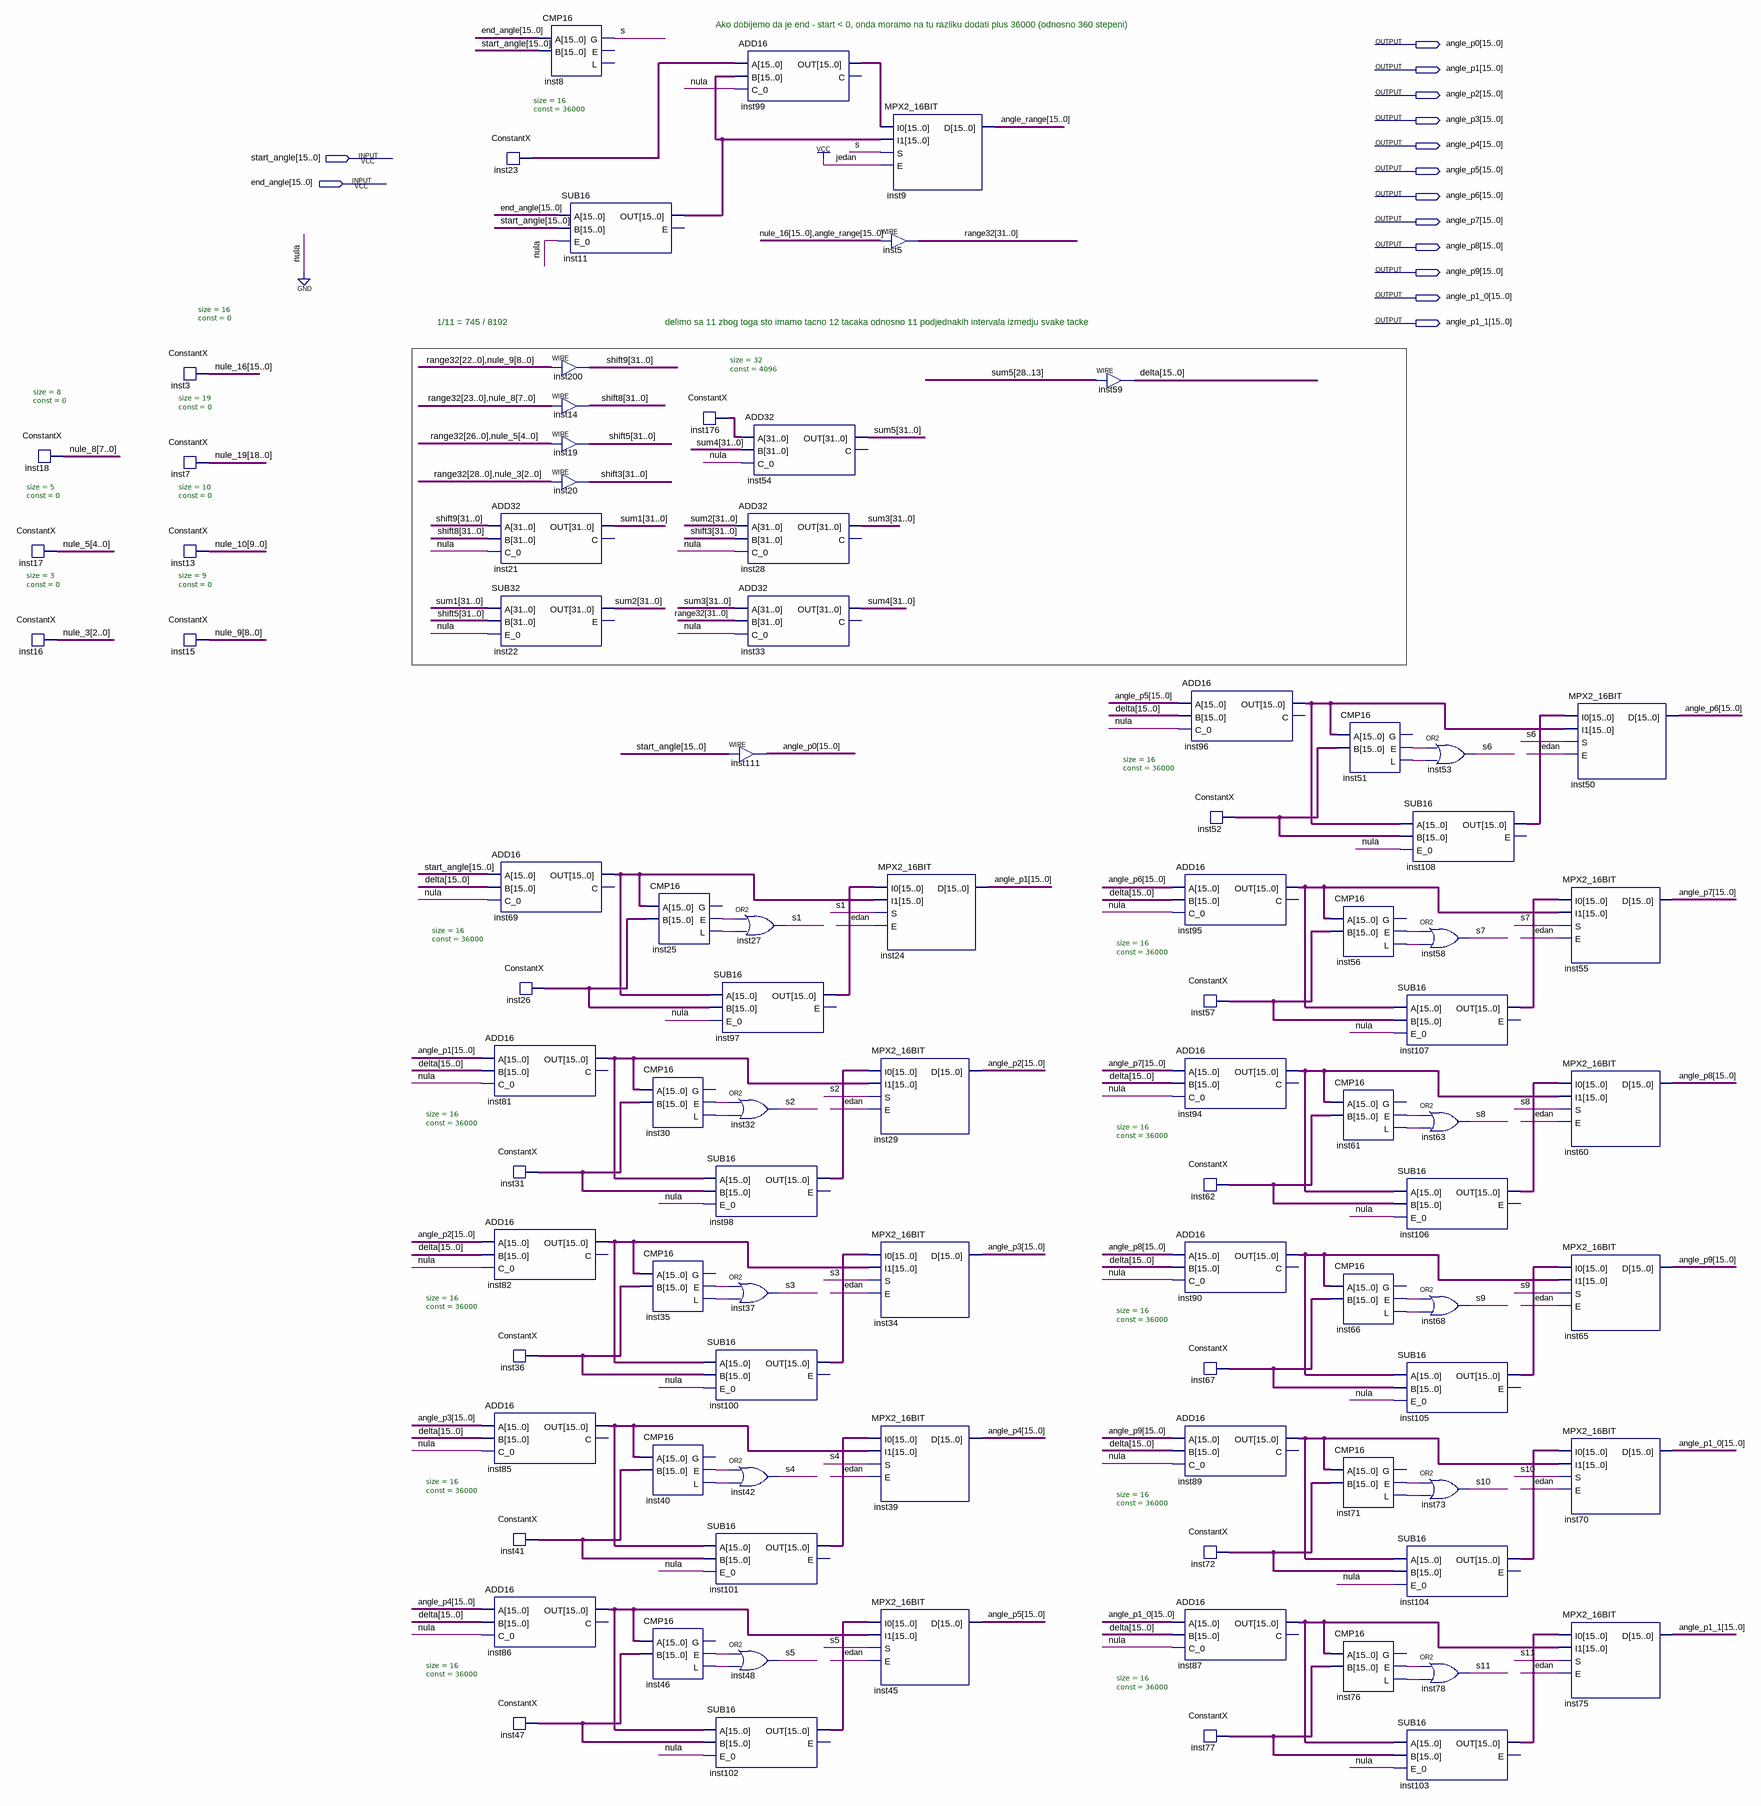
[diagram p0: schematic sheet]
// Quartus schematic AngleGenerator.bdf as structural Verilog: 91 symbols, 14 pins
module AngleGenerator (
  input  [15:0] start_angle,
  input  [15:0] end_angle,
  output [15:0] angle_p0,
  output [15:0] angle_p1,
  output [15:0] angle_p2,
  output [15:0] angle_p3,
  output [15:0] angle_p4,
  output [15:0] angle_p5,
  output [15:0] angle_p6,
  output [15:0] angle_p7,
  output [15:0] angle_p8,
  output [15:0] angle_p9,
  output [15:0] angle_p1_0,
  output [15:0] angle_p1_1
);

  wire inst25_e, inst25_l, inst30_e, inst30_l, inst35_e, inst35_l, inst40_e, inst40_l, inst46_e, inst46_l,
       inst51_e, inst51_l, inst56_e, inst56_l, inst61_e, inst61_l, inst66_e, inst66_l, inst71_e, inst71_l,
       inst76_e, inst76_l, s, s1, s2, s3, s4, s5, s6, s7, s8, s9, s10, s11;
  wire [2:0] nule_3;
  wire [4:0] nule_5;
  wire [7:0] nule_8;
  wire [8:0] nule_9;
  wire [9:0] nule_10;
  wire [15:0] angle_range, delta, inst11_out, inst23_data_out, inst26_data_out, inst31_data_out,
       inst36_data_out, inst41_data_out, inst47_data_out, inst52_data_out, inst57_data_out, inst62_data_out,
       inst67_data_out, inst69_out, inst72_data_out, inst77_data_out, inst81_out, inst82_out, inst85_out,
       inst86_out, inst87_out, inst89_out, inst90_out, inst94_out, inst95_out, inst96_out, inst97_out,
       inst98_out, inst99_out, inst100_out, inst101_out, inst102_out, inst103_out, inst104_out, inst105_out,
       inst106_out, inst107_out, inst108_out, nule_16;
  wire [18:0] nule_19;
  wire [31:0] inst176_data_out, range32, shift3, shift5, shift8, shift9, sum1, sum2, sum3, sum4, sum5;

  ConstantX #(.size(8), .\const (0)) inst18 (.DATA_OUT(nule_8));
  ConstantX #(.size(5), .\const (0)) inst17 (.DATA_OUT(nule_5));
  ConstantX #(.size(3), .\const (0)) inst16 (.DATA_OUT(nule_3));
  ConstantX #(.size(16), .\const (0)) inst3 (.DATA_OUT(nule_16));
  ConstantX #(.size(19), .\const (0)) inst7 (.DATA_OUT(nule_19));
  ConstantX #(.size(10), .\const (0)) inst13 (.DATA_OUT(nule_10));
  ConstantX #(.size(9), .\const (0)) inst15 (.DATA_OUT(nule_9));
  ConstantX #(.size(16), .\const (36000)) inst23 (.DATA_OUT(inst23_data_out));
  ADD32 inst21 (.A(shift9), .B(shift8), .C_0(1'b0), .OUT(sum1));  // open: C
  SUB32 inst22 (.A(sum1), .B(shift5), .E_0(1'b0), .OUT(sum2));  // open: E
  ADD16 inst69 (.A(start_angle), .B(delta), .C_0(1'b0), .OUT(inst69_out));  // open: C
  ConstantX #(.size(16), .\const (36000)) inst26 (.DATA_OUT(inst26_data_out));
  ADD16 inst81 (.A(angle_p1), .B(delta), .C_0(1'b0), .OUT(inst81_out));  // open: C
  ConstantX #(.size(16), .\const (36000)) inst31 (.DATA_OUT(inst31_data_out));
  ADD16 inst82 (.A(angle_p2), .B(delta), .C_0(1'b0), .OUT(inst82_out));  // open: C
  ConstantX #(.size(16), .\const (36000)) inst36 (.DATA_OUT(inst36_data_out));
  ADD16 inst85 (.A(angle_p3), .B(delta), .C_0(1'b0), .OUT(inst85_out));  // open: C
  ConstantX #(.size(16), .\const (36000)) inst41 (.DATA_OUT(inst41_data_out));
  ADD16 inst86 (.A(angle_p4), .B(delta), .C_0(1'b0), .OUT(inst86_out));  // open: C
  ConstantX #(.size(16), .\const (36000)) inst47 (.DATA_OUT(inst47_data_out));
  CMP16 inst8 (.A(end_angle), .B(start_angle), .G(s));  // open: E, L
  SUB16 inst11 (.A(end_angle), .B(start_angle), .E_0(1'b0), .OUT(inst11_out));  // open: E
  assign shift9 = {range32[22:0], nule_9};  // WIRE inst200
  assign shift8 = {range32[23:0], nule_8};  // WIRE inst14
  assign shift5 = {range32[26:0], nule_5};  // WIRE inst19
  assign shift3 = {range32[28:0], nule_3};  // WIRE inst20
  CMP16 inst25 (.A(inst69_out), .B(inst26_data_out), .E(inst25_e), .L(inst25_l));  // open: G
  CMP16 inst30 (.A(inst81_out), .B(inst31_data_out), .E(inst30_e), .L(inst30_l));  // open: G
  CMP16 inst35 (.A(inst82_out), .B(inst36_data_out), .E(inst35_e), .L(inst35_l));  // open: G
  CMP16 inst40 (.A(inst85_out), .B(inst41_data_out), .E(inst40_e), .L(inst40_l));  // open: G
  CMP16 inst46 (.A(inst86_out), .B(inst47_data_out), .E(inst46_e), .L(inst46_l));  // open: G
  ConstantX #(.size(32), .\const (4096)) inst176 (.DATA_OUT(inst176_data_out));
  SUB16 inst97 (.A(inst69_out), .B(inst26_data_out), .E_0(1'b0), .OUT(inst97_out));  // open: E
  SUB16 inst98 (.A(inst81_out), .B(inst31_data_out), .E_0(1'b0), .OUT(inst98_out));  // open: E
  SUB16 inst100 (.A(inst82_out), .B(inst36_data_out), .E_0(1'b0), .OUT(inst100_out));  // open: E
  SUB16 inst101 (.A(inst85_out), .B(inst41_data_out), .E_0(1'b0), .OUT(inst101_out));  // open: E
  SUB16 inst102 (.A(inst86_out), .B(inst47_data_out), .E_0(1'b0), .OUT(inst102_out));  // open: E
  ADD16 inst99 (.A(inst23_data_out), .B(inst11_out), .C_0(1'b0), .OUT(inst99_out));  // open: C
  ADD32 inst54 (.A(inst176_data_out), .B(sum4), .C_0(1'b0), .OUT(sum5));  // open: C
  ADD32 inst28 (.A(sum2), .B(shift3), .C_0(1'b0), .OUT(sum3));  // open: C
  ADD32 inst33 (.A(sum3), .B(range32), .C_0(1'b0), .OUT(sum4));  // open: C
  assign angle_p0 = start_angle;  // WIRE inst111
  or inst27 (s1, inst25_e, inst25_l);
  or inst32 (s2, inst30_e, inst30_l);
  or inst37 (s3, inst35_e, inst35_l);
  or inst42 (s4, inst40_e, inst40_l);
  or inst48 (s5, inst46_e, inst46_l);
  MPX2_16BIT inst9 (.I0(inst99_out), .I1(inst11_out), .S(s), .E(1'b1), .D(angle_range));
  assign range32 = {nule_16, angle_range};  // WIRE inst5
  MPX2_16BIT inst24 (.I0(inst97_out), .I1(inst69_out), .S(s1), .E(1'b1), .D(angle_p1));
  MPX2_16BIT inst29 (.I0(inst98_out), .I1(inst81_out), .S(s2), .E(1'b1), .D(angle_p2));
  MPX2_16BIT inst34 (.I0(inst100_out), .I1(inst82_out), .S(s3), .E(1'b1), .D(angle_p3));
  MPX2_16BIT inst39 (.I0(inst101_out), .I1(inst85_out), .S(s4), .E(1'b1), .D(angle_p4));
  MPX2_16BIT inst45 (.I0(inst102_out), .I1(inst86_out), .S(s5), .E(1'b1), .D(angle_p5));
  assign delta = sum5[28:13];  // WIRE inst59
  ADD16 inst96 (.A(angle_p5), .B(delta), .C_0(1'b0), .OUT(inst96_out));  // open: C
  ConstantX #(.size(16), .\const (36000)) inst52 (.DATA_OUT(inst52_data_out));
  ADD16 inst95 (.A(angle_p6), .B(delta), .C_0(1'b0), .OUT(inst95_out));  // open: C
  ConstantX #(.size(16), .\const (36000)) inst57 (.DATA_OUT(inst57_data_out));
  ADD16 inst94 (.A(angle_p7), .B(delta), .C_0(1'b0), .OUT(inst94_out));  // open: C
  ConstantX #(.size(16), .\const (36000)) inst62 (.DATA_OUT(inst62_data_out));
  ADD16 inst90 (.A(angle_p8), .B(delta), .C_0(1'b0), .OUT(inst90_out));  // open: C
  ConstantX #(.size(16), .\const (36000)) inst67 (.DATA_OUT(inst67_data_out));
  ADD16 inst89 (.A(angle_p9), .B(delta), .C_0(1'b0), .OUT(inst89_out));  // open: C
  ConstantX #(.size(16), .\const (36000)) inst72 (.DATA_OUT(inst72_data_out));
  ADD16 inst87 (.A(angle_p1_0), .B(delta), .C_0(1'b0), .OUT(inst87_out));  // open: C
  ConstantX #(.size(16), .\const (36000)) inst77 (.DATA_OUT(inst77_data_out));
  CMP16 inst51 (.A(inst96_out), .B(inst52_data_out), .E(inst51_e), .L(inst51_l));  // open: G
  CMP16 inst56 (.A(inst95_out), .B(inst57_data_out), .E(inst56_e), .L(inst56_l));  // open: G
  CMP16 inst61 (.A(inst94_out), .B(inst62_data_out), .E(inst61_e), .L(inst61_l));  // open: G
  CMP16 inst66 (.A(inst90_out), .B(inst67_data_out), .E(inst66_e), .L(inst66_l));  // open: G
  CMP16 inst71 (.A(inst89_out), .B(inst72_data_out), .E(inst71_e), .L(inst71_l));  // open: G
  CMP16 inst76 (.A(inst87_out), .B(inst77_data_out), .E(inst76_e), .L(inst76_l));  // open: G
  SUB16 inst108 (.A(inst96_out), .B(inst52_data_out), .E_0(1'b0), .OUT(inst108_out));  // open: E
  or inst58 (s7, inst56_e, inst56_l);
  SUB16 inst107 (.A(inst95_out), .B(inst57_data_out), .E_0(1'b0), .OUT(inst107_out));  // open: E
  or inst63 (s8, inst61_e, inst61_l);
  SUB16 inst106 (.A(inst94_out), .B(inst62_data_out), .E_0(1'b0), .OUT(inst106_out));  // open: E
  or inst68 (s9, inst66_e, inst66_l);
  SUB16 inst105 (.A(inst90_out), .B(inst67_data_out), .E_0(1'b0), .OUT(inst105_out));  // open: E
  or inst73 (s10, inst71_e, inst71_l);
  SUB16 inst104 (.A(inst89_out), .B(inst72_data_out), .E_0(1'b0), .OUT(inst104_out));  // open: E
  or inst78 (s11, inst76_e, inst76_l);
  SUB16 inst103 (.A(inst87_out), .B(inst77_data_out), .E_0(1'b0), .OUT(inst103_out));  // open: E
  or inst53 (s6, inst51_e, inst51_l);
  MPX2_16BIT inst50 (.I0(inst108_out), .I1(inst96_out), .S(s6), .E(1'b1), .D(angle_p6));
  MPX2_16BIT inst55 (.I0(inst107_out), .I1(inst95_out), .S(s7), .E(1'b1), .D(angle_p7));
  MPX2_16BIT inst60 (.I0(inst106_out), .I1(inst94_out), .S(s8), .E(1'b1), .D(angle_p8));
  MPX2_16BIT inst65 (.I0(inst105_out), .I1(inst90_out), .S(s9), .E(1'b1), .D(angle_p9));
  MPX2_16BIT inst70 (.I0(inst104_out), .I1(inst89_out), .S(s10), .E(1'b1), .D(angle_p1_0));
  MPX2_16BIT inst75 (.I0(inst103_out), .I1(inst87_out), .S(s11), .E(1'b1), .D(angle_p1_1));

  // Notes on the sheet:
  //   Ako dobijemo da je end - start < 0, onda moramo na tu razliku dodati plus 36000 (odnosno 360 stepeni)
  //   1/11 = 745 / 8192
  //   delimo sa 11 zbog toga sto imamo tacno 12 tacaka odnosno 11 podjednakih intervala izmedju svake tacke
endmodule
